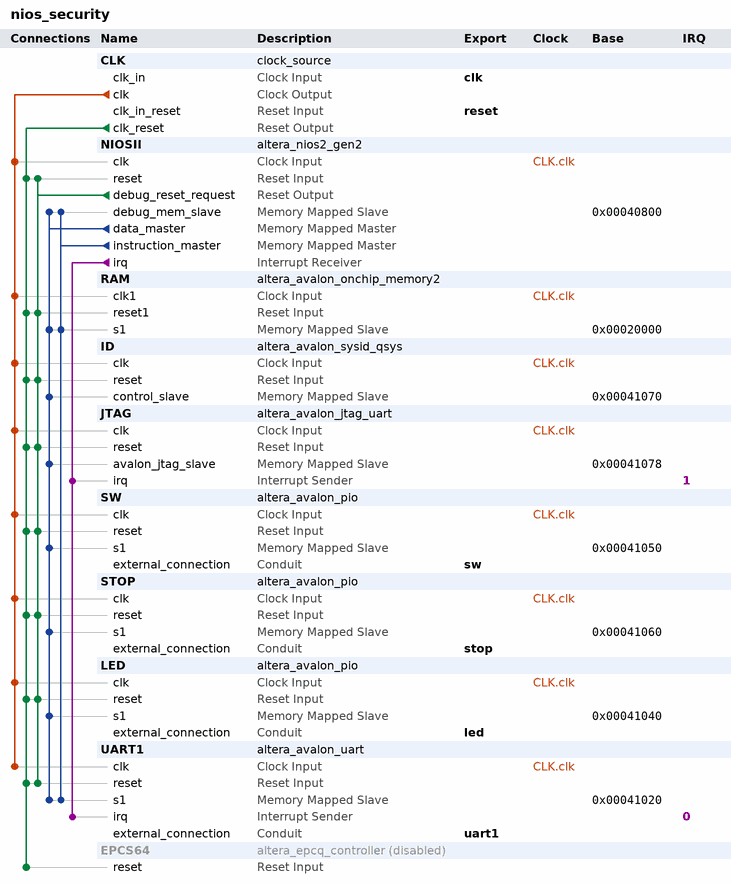
[diagram p0: system contents]
# Platform Designer (Qsys) system nios_security, MAX 10 10M50DAF484C7G
# Parameters at their usual value, and those the tool derives, are not listed.
package require -exact qsys 18.1
create_system nios_security
set_project_property DEVICE_FAMILY {MAX 10}
set_project_property DEVICE 10M50DAF484C7G

add_instance CLK clock_source 18.1
set_instance_parameter_value CLK clockFrequency 50000000

add_instance NIOSII altera_nios2_gen2 18.1
set_instance_parameter_value NIOSII dcache_size 2048
set_instance_parameter_value NIOSII exceptionSlave RAM.s1
set_instance_parameter_value NIOSII icache_size 4096
set_instance_parameter_value NIOSII impl Tiny
set_instance_parameter_value NIOSII resetSlave RAM.s1

add_instance RAM altera_avalon_onchip_memory2 18.1
set_instance_parameter_value RAM dataWidth 32
set_instance_parameter_value RAM dualPort false
set_instance_parameter_value RAM initMemContent false
set_instance_parameter_value RAM initializationFileName onchip_mem.hex
set_instance_parameter_value RAM memorySize 131072

add_instance ID altera_avalon_sysid_qsys 18.1
set_instance_parameter_value ID id 0

add_instance JTAG altera_avalon_jtag_uart 18.1
set_instance_parameter_value JTAG simInteractiveOptions NO_INTERACTIVE_WINDOWS

add_instance SW altera_avalon_pio 18.1
set_instance_parameter_value SW direction Input
set_instance_parameter_value SW width 16

add_instance STOP altera_avalon_pio 18.1
set_instance_parameter_value STOP direction Output
set_instance_parameter_value STOP width 32

add_instance LED altera_avalon_pio 18.1
set_instance_parameter_value LED direction Output
set_instance_parameter_value LED width 32

add_instance UART1 altera_avalon_uart 18.1
set_instance_parameter_value UART1 baud 9600
set_instance_parameter_value UART1 dataBits 8
set_instance_parameter_value UART1 fixedBaud true
set_instance_parameter_value UART1 parity NONE
set_instance_parameter_value UART1 stopBits 1

add_instance EPCS64 altera_epcq_controller 18.1
set_instance_property EPCS64 ENABLED false
set_instance_parameter_value EPCS64 CHIP_SELS 1
set_instance_parameter_value EPCS64 DDASI 0
set_instance_parameter_value EPCS64 FLASH_TYPE EPCS64
set_instance_parameter_value EPCS64 IO_MODE STANDARD
set_instance_parameter_value EPCS64 UNIQUE_ID nios_security_EPCS64
set_instance_parameter_value EPCS64 clkFreq 25000000

# connections
add_connection CLK.clk ID.clk clock
add_connection CLK.clk JTAG.clk clock
add_connection CLK.clk LED.clk clock
add_connection CLK.clk NIOSII.clk clock
add_connection CLK.clk RAM.clk1 clock
add_connection CLK.clk STOP.clk clock
add_connection CLK.clk SW.clk clock
add_connection CLK.clk UART1.clk clock
add_connection CLK.clk_reset EPCS64.reset reset
add_connection CLK.clk_reset ID.reset reset
add_connection CLK.clk_reset JTAG.reset reset
add_connection CLK.clk_reset LED.reset reset
add_connection CLK.clk_reset NIOSII.reset reset
add_connection CLK.clk_reset RAM.reset1 reset
add_connection CLK.clk_reset STOP.reset reset
add_connection CLK.clk_reset SW.reset reset
add_connection CLK.clk_reset UART1.reset reset
add_connection NIOSII.debug_reset_request ID.reset reset
add_connection NIOSII.debug_reset_request JTAG.reset reset
add_connection NIOSII.debug_reset_request LED.reset reset
add_connection NIOSII.debug_reset_request NIOSII.reset reset
add_connection NIOSII.debug_reset_request RAM.reset1 reset
add_connection NIOSII.debug_reset_request STOP.reset reset
add_connection NIOSII.debug_reset_request SW.reset reset
add_connection NIOSII.debug_reset_request UART1.reset reset
add_connection NIOSII.data_master ID.control_slave avalon
set_connection_parameter_value NIOSII.data_master/ID.control_slave baseAddress 0x00041070
add_connection NIOSII.data_master JTAG.avalon_jtag_slave avalon
set_connection_parameter_value NIOSII.data_master/JTAG.avalon_jtag_slave baseAddress 0x00041078
add_connection NIOSII.data_master LED.s1 avalon
set_connection_parameter_value NIOSII.data_master/LED.s1 baseAddress 0x00041040
add_connection NIOSII.data_master NIOSII.debug_mem_slave avalon
set_connection_parameter_value NIOSII.data_master/NIOSII.debug_mem_slave baseAddress 0x00040800
add_connection NIOSII.data_master RAM.s1 avalon
set_connection_parameter_value NIOSII.data_master/RAM.s1 baseAddress 0x00020000
add_connection NIOSII.data_master STOP.s1 avalon
set_connection_parameter_value NIOSII.data_master/STOP.s1 baseAddress 0x00041060
add_connection NIOSII.data_master SW.s1 avalon
set_connection_parameter_value NIOSII.data_master/SW.s1 baseAddress 0x00041050
add_connection NIOSII.data_master UART1.s1 avalon
set_connection_parameter_value NIOSII.data_master/UART1.s1 baseAddress 0x00041020
add_connection NIOSII.instruction_master NIOSII.debug_mem_slave avalon
set_connection_parameter_value NIOSII.instruction_master/NIOSII.debug_mem_slave baseAddress 0x00040800
add_connection NIOSII.instruction_master RAM.s1 avalon
set_connection_parameter_value NIOSII.instruction_master/RAM.s1 baseAddress 0x00020000
add_connection NIOSII.instruction_master UART1.s1 avalon
set_connection_parameter_value NIOSII.instruction_master/UART1.s1 baseAddress 0x00041020
add_connection NIOSII.irq JTAG.irq interrupt
set_connection_parameter_value NIOSII.irq/JTAG.irq irqNumber 1
add_connection NIOSII.irq UART1.irq interrupt
set_connection_parameter_value NIOSII.irq/UART1.irq irqNumber 0

# exported interfaces
add_interface clk clock sink
set_interface_property clk EXPORT_OF CLK.clk_in
add_interface led conduit end
set_interface_property led EXPORT_OF LED.external_connection
add_interface reset reset sink
set_interface_property reset EXPORT_OF CLK.clk_in_reset
add_interface stop conduit end
set_interface_property stop EXPORT_OF STOP.external_connection
add_interface sw conduit end
set_interface_property sw EXPORT_OF SW.external_connection
add_interface uart1 conduit end
set_interface_property uart1 EXPORT_OF UART1.external_connection

set_interconnect_requirement {$system} qsys_mm.clockCrossingAdapter HANDSHAKE
set_interconnect_requirement {$system} qsys_mm.enableEccProtection FALSE
set_interconnect_requirement {$system} qsys_mm.insertDefaultSlave FALSE
set_interconnect_requirement {$system} qsys_mm.maxAdditionalLatency 1

save_system nios_security.qsys
